# EAGLE schematic R409J (EAGLE 6.6.0)
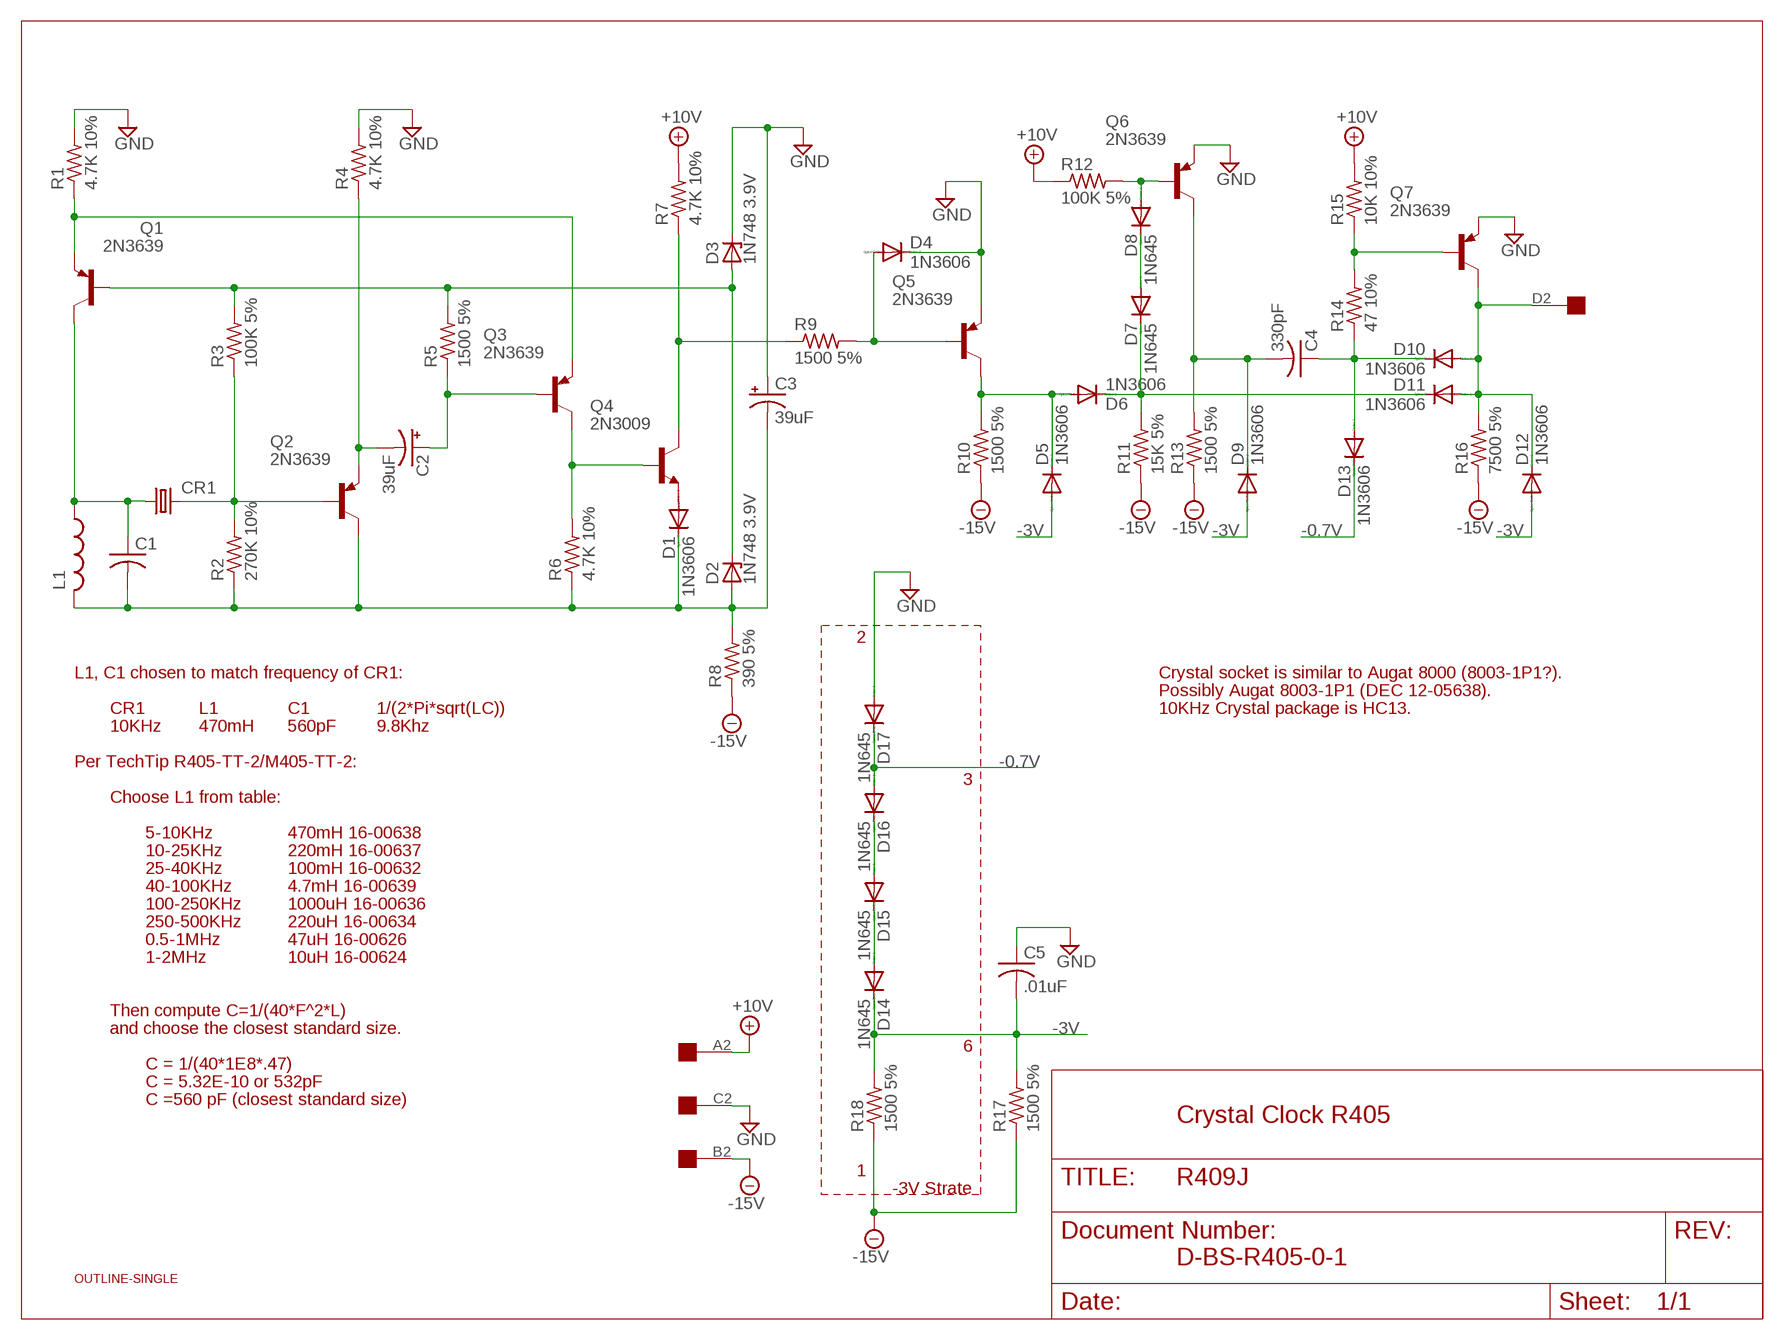
[diagram p0: schematic, sheet 1]

## Parts
C1  C-US150-054X183  [C150-054X183]
C2  39uF  CPOL-USE15-5AXIAL  [E15-5]
C3  39uF  CPOL-USE15-5AXIAL  [E15-5]
C4  330pF  C-US150-054X183  [C150-054X183]
C5  .01uF  C-US150-054X183  [C150-054X183]
CR1  CRYSTALHC13U-H  [HC13U-H]
D1  1N3606  1N4148DO35-10  [DO35-10]
D2  1N748 3.9V  ZENER-DIODEDO35Z10  [DO35Z10]
D3  1N748 3.9V  ZENER-DIODEDO35Z10  [DO35Z10]
D4  1N3606  1N4148DO35-10  [DO35-10]
D5  1N3606  1N4148DO35-10  [DO35-10]
D6  1N3606  1N4148DO35-10  [DO35-10]
D7  1N645  1N4148DO35-10  [DO35-10]
D8  1N645  1N4148DO35-10  [DO35-10]
D9  1N3606  1N4148DO35-10  [DO35-10]
D10  1N3606  1N4148DO35-10  [DO35-10]
D11  1N3606  1N4148DO35-10  [DO35-10]
D12  1N3606  1N4148DO35-10  [DO35-10]
D13  1N3606  1N4148DO35-10  [DO35-10]
D14  1N645  1N4148DO35-10  [DO35-10]
D15  1N645  1N4148DO35-10  [DO35-10]
D16  1N645  1N4148DO35-10  [DO35-10]
D17  1N645  1N4148DO35-10  [DO35-10]
L1  L-US0207/7  [0207/7]
Q1  2N3639  2N2904  [TO39]
Q2  2N3639  2N2904  [TO39]
Q3  2N3639  2N2904  [TO39]
Q4  2N3009  2N2102  [TO5]
Q5  2N3639  2N2904  [TO39]
Q6  2N3639  2N2904  [TO39]
Q7  2N3639  2N2904  [TO39]
R1  4.7K 10%  R-US_0207/10  [0207/10]
R2  270K 10%  R-US_0207/10  [0207/10]
R3  100K 5%  R-US_0207/10  [0207/10]
R4  4.7K 10%  R-US_0207/10  [0207/10]
R5  1500 5%  R-US_0207/10  [0207/10]
R6  4.7K 10%  R-US_0207/10  [0207/10]
R7  4.7K 10%  R-US_0207/10  [0207/10]
R8  390 5%  R-US_0207/10  [0207/10]
R9  1500 5%  R-US_0207/10  [0207/10]
R10  1500 5%  R-US_0207/10  [0207/10]
R11  15K 5%  R-US_0207/10  [0207/10]
R12  100K 5%  R-US_0207/10  [0207/10]
R13  1500 5%  R-US_0207/10  [0207/10]
R14  47 10%  R-US_0207/10  [0207/10]
R15  10K 10%  R-US_0207/10  [0207/10]
R16  7500 5%  R-US_0207/10  [0207/10]
R17  1500 5%  R-US_0207/10  [0207/10]
R18  1500 5%  R-US_0207/10  [0207/10]
U$1  OUTLINE-SINGLE  [SINGLE]
U$2  EDGE-1  [EDGE-CON1]

## Nets
+10V [Supply]: R7.2 R12.1 R15.2 U$2.A2
-0.7V [Supply]: D13.C D16.A D17.C
-3V [Supply]: C5.2 D5.A D9.A D12.A D14.C R17.2 R18.2
-15V [Supply]: R8.1 R10.1 R11.1 R13.1 R16.1 R17.1 R18.1 U$2.B2
GND [Supply]: C3.+ C5.1 D3.C D4.C D17.A Q5.1(E) Q6.1(E) Q7.1(E) R1.2 R4.2 U$2.C2
N$1: Q1.1(E) Q3.1(E) R1.1
N$2: C1.1 CR1.1 L1.1 Q1.3(C)
N$3: C1.2 C3.- D1.C D2.A L1.2 Q2.3(C) R2.1 R6.1 R8.2
N$4: C2.- Q2.1(E) R4.1
N$5: D1.A Q4.1(E)
N$6: CR1.2 Q2.2(B) R2.2 R3.1
N$7: D2.C D3.A Q1.2(B) R3.2 R5.2
N$8 [Supply]: D15.A D16.C
N$9 [Supply]: D14.A D15.C
N$10: C2.+ Q3.2(B) R5.1
N$11: Q3.3(C) Q4.2(B) R6.2
N$12: Q4.3(C) R7.1 R9.1
N$13: D4.A Q5.2(B) R9.2
N$14: D5.C D6.A Q5.3(C) R10.2
N$15: D8.A Q6.2(B) R12.2
N$16: D7.A D8.C
N$17: D6.C D7.C D11.C R11.2
N$18: C4.2 D9.C Q6.3(C) R13.2
N$19: C4.1 D10.C D13.A R14.1
N$20: Q7.2(B) R14.2 R15.1
N$21: D10.A D11.A D12.C Q7.3(C) R16.2 U$2.D2
Unconnected: U$2.E2 U$2.F2 U$2.H2 U$2.J2 U$2.K2 U$2.L2 U$2.M2 U$2.N2 U$2.P2 U$2.R2 U$2.S2 U$2.T2 U$2.U2 U$2.V2

## Notes on the sheet
- 2
- L1, C1 chosen to match frequency of CR1: | Crystal socket is similar to Augat 8000 (8003-1P1?).
- Possibly Augat 8003-1P1 (DEC 12-05638).
- CR1 | L1 | C1 | 1/(2*Pi*sqrt(LC)) | 10KHz Crystal package is HC13.
- 10KHz | 470mH | 560pF | 9.8Khz
- Per TechTip R405-TT-2/M405-TT-2:
- 3
- Choose L1 from table:
- 5-10KHz | 470mH 16-00638
- 10-25KHz | 220mH 16-00637
- 25-40KHz | 100mH 16-00632
- 40-100KHz | 4.7mH 16-00639
- 100-250KHz | 1000uH 16-00636
- 250-500KHz | 220uH 16-00634
- 0.5-1MHz | 47uH 16-00626
- 1-2MHz | 10uH 16-00624
- Then compute C=1/(40*F^2*L)
- and choose the closest standard size.
- 6
- C = 1/(40*1E8*.47)
- C = 5.32E-10 or 532pF
- C =560 pF (closest standard size)
- Crystal Clock R405
- 1
- -3V Strate
- D-BS-R405-0-1

## Library data of the parts
C1 C4 C5 = rcl:C-US: CAPACITOR, American symbol
C2 C3 = rcl:CPOL-US: POLARIZED CAPACITOR, American symbol
CR1 = crystal:CRYSTAL: CRYSTAL; OC_FARNELL: unknown; OC_NEWARK: unknown
D1 D4-D17 = diode:1N4148: DIODE high speed (Philips)
D2 D3 = diode:ZENER-DIODE: Z-Diode
L1 = rcl:L-US: INDUCTOR, American symbol
Q1-Q3 Q5-Q7 = transistor-pnp:2N2904*: PNP Transistror
Q4 = transistor-npn:2N2102: NPN Transistor
R1-R18 = rcl:R-US_: RESISTOR, American symbol
U$1 = dec-con:OUTLINE-*: Board outlines for DEC boards.
U$2 = dec-con:EDGE-1: Single-Sided DEC Edge Connector -- (side 2)

## Net classes
1 Supply: width 0.813 mm